# Altium schematic sheet Activity_Recognition_Board_v1.0_MCU.SchDoc
size A4
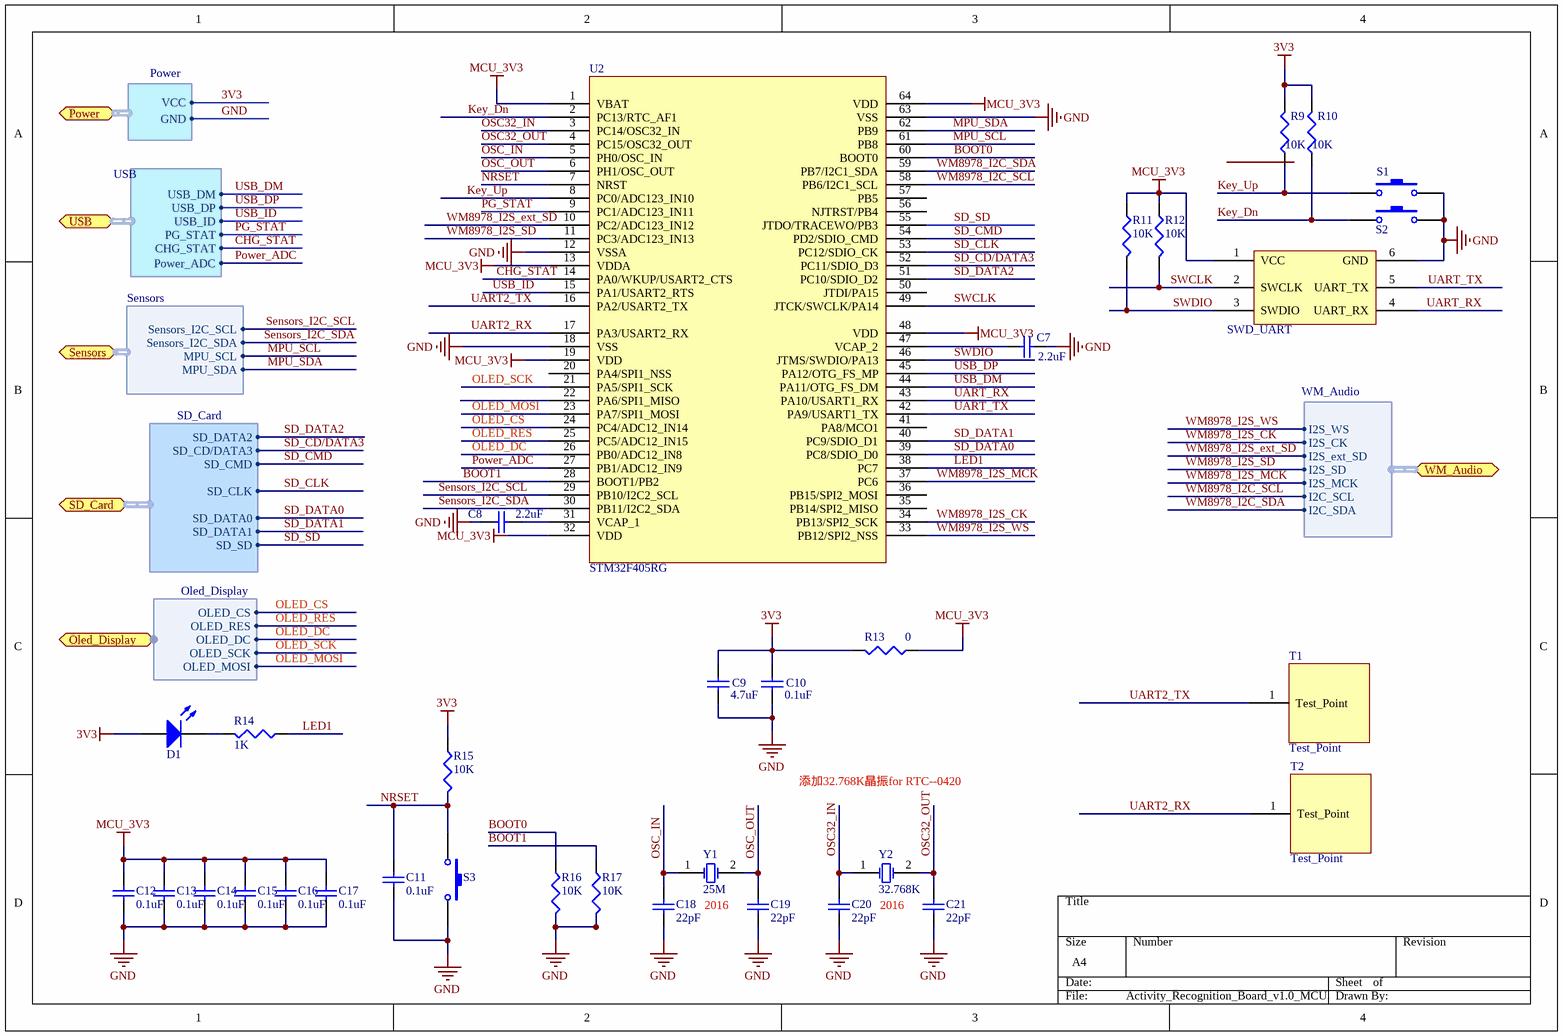
[diagram p0: Activity_Recognition_Board_v1.0_MCU.SchDoc]

## Parts
C7  value 2.2uF  [C0603]  (hidden comment: Cap semi)
C8  value 2.2uF  [C0603]  (hidden comment: Cap semi)
C9  value 4.7uF  [C0603]  (hidden comment: Cap semi)
C10  value 0.1uF  [C0402]  (hidden comment: Cap semi)
C11  value 0.1uF  [C0402]  (hidden comment: Cap semi)
C12  value 0.1uF  [C0402]  (hidden comment: Cap semi)
C13  value 0.1uF  [C0402]  (hidden comment: Cap semi)
C14  value 0.1uF  [C0402]  (hidden comment: Cap semi)
C15  value 0.1uF  [C0402]  (hidden comment: Cap semi)
C16  value 0.1uF  [C0402]  (hidden comment: Cap semi)
C17  value 0.1uF  [C0402]  (hidden comment: Cap semi)
C18  value 22pF  [C0402]  (hidden comment: Cap semi)
C19  value 22pF  [C0402]  (hidden comment: Cap semi)
C20  value 22pF  [C0402]  (hidden comment: Cap semi)
C21  value 22pF  [C0402]  (hidden comment: Cap semi)
D1  LED3  [LED0603]  (value not drawn)
R9  value 10K  [R0402]  (hidden comment: Res3)
R10  value 10K  [R0402]  (hidden comment: Res3)
R11  value 10K  [R0402]  (hidden comment: Res3)
R12  value 10K  [R0402]  (hidden comment: Res3)
R13  value 0  [R0603]  (hidden comment: Res3)
R14  value 1K  [R0402]  (hidden comment: Res3)
R15  value 10K  [R0402]  (hidden comment: Res3)
R16  value 10K  [R0402]  (hidden comment: Res3)
R17  value 10K  [R0402]  (hidden comment: Res3)
S1  SW-PB  [MP34]  (value not drawn)
S2  SW-PB  [MP34]  (value not drawn)
S3  SW-PB  [MP34]  (value not drawn)
SWD_UART1  SWD_UART  [FFC_6]
T1  Test_Point  [Test_Point]
T2  Test_Point  [Test_Point]
U2  STM32F405RG  [LQFP64]
Y1  25M  [3225]
Y2  32.768K  [3215]

## Ports
Oled_Display (harness Oled_Display), Power (harness Power), SD_Card (harness SD_Card), Sensors (harness Sensors), USB (harness USB), WM_Audio (harness WM_Audio)

## Harnesses
Power: VCC, GND
USB: USB_DM, USB_DP, USB_ID, PG_STAT, CHG_STAT, Power_ADC
Sensors: Sensors_I2C_SCL, Sensors_I2C_SDA, MPU_SDA, MPU_SCL
SD_Card: SD_DATA2, SD_CMD, SD_CD/DATA3, SD_CLK, SD_DATA0, SD_DATA1, SD_SD
WM_Audio: I2S_WS, I2S_CK, I2S_ext_SD, I2S_SD, I2S_MCK, I2C_SCL, I2C_SDA
Oled_Display: OLED_CS, OLED_RES, OLED_DC, OLED_SCK, OLED_MOSI

## Nets
3V3: C9.1 C10.1 D1.1(A) R9.2 R10.2 R13.2 R15.1 ; port Power.VCC
GND: C7.1 C8.2 C9.2 C10.2 C11.1 C12.1 C13.1 C14.1 C15.1 C16.1 C17.1 C18.1 C19.1 C20.1 C21.1 R16.2 R17.2 S1.2 S2.2 S3.2 SWD_UART1.6(GND) U2.12(VSSA) U2.18(VSS) U2.63(VSS) ; port Power.GND
MCU_3V3: C12.2 C13.2 C14.2 C15.2 C16.2 C17.2 R11.1 R12.1 R13.1 SWD_UART1.1(VCC) U2.1(VBAT) U2.13(VDDA) U2.19(VDD) U2.32(VDD) U2.48(VDD) U2.64(VDD)
BOOT0: R16.1 U2.60(BOOT0)
BOOT1: R17.1 U2.28(BOOT1/PB2)
CHG_STAT: U2.14(PA0/WKUP/USART2_CTS) ; port USB.CHG_STAT
Key_Dn: R10.1 S2.1 U2.2(PC13/RTC_AF1)
Key_Up: R9.1 S1.1 U2.8(PC0/ADC123_IN10)
LED1: R14.1 U2.38(PC7)
MPU_SCL: U2.61(PB8) ; port Sensors.MPU_SCL
MPU_SDA: U2.62(PB9) ; port Sensors.MPU_SDA
NRSET: C11.2 R15.2 S3.1 U2.7(NRST)
OLED_CS: U2.24(PC4/ADC12_IN14) ; port Oled_Display.OLED_CS
OLED_DC: U2.26(PB0/ADC12_IN8) ; port Oled_Display.OLED_DC
OLED_MOSI: U2.23(PA7/SPI1_MOSI) ; port Oled_Display.OLED_MOSI
OLED_RES: U2.25(PC5/ADC12_IN15) ; port Oled_Display.OLED_RES
OLED_SCK: U2.21(PA5/SPI1_SCK) ; port Oled_Display.OLED_SCK
OSC32_IN: C20.2 U2.3(PC14/OSC32_IN) Y2.1(OSC1)
OSC32_OUT: C21.2 U2.4(PC15/OSC32_OUT) Y2.2(OSC2)
OSC_IN: C18.2 U2.5(PH0/OSC_IN) Y1.1(OSC1)
OSC_OUT: C19.2 U2.6(PH1/OSC_OUT) Y1.2(OSC2)
PG_STAT: U2.9(PC1/ADC123_IN11) ; port USB.PG_STAT
Power_ADC: U2.27(PB1/ADC12_IN9) ; port USB.Power_ADC
SD_CD/DATA3: U2.52(PC11/SDIO_D3) ; port SD_Card.SD_CD/DATA3
SD_CLK: U2.53(PC12/SDIO_CK) ; port SD_Card.SD_CLK
SD_CMD: U2.54(PD2/SDIO_CMD) ; port SD_Card.SD_CMD
SD_DATA0: U2.39(PC8/SDIO_D0) ; port SD_Card.SD_DATA0
SD_DATA1: U2.40(PC9/SDIO_D1) ; port SD_Card.SD_DATA1
SD_DATA2: U2.51(PC10/SDIO_D2) ; port SD_Card.SD_DATA2
SD_SD: U2.55(JTDO/TRACEWO/PB3) ; port SD_Card.SD_SD
Sensors_I2C_SCL: U2.29(PB10/I2C2_SCL) ; port Sensors.Sensors_I2C_SCL
Sensors_I2C_SDA: U2.30(PB11/I2C2_SDA) ; port Sensors.Sensors_I2C_SDA
SWCLK: R12.2 SWD_UART1.2(SWCLK) U2.49(JTCK/SWCLK/PA14)
SWDIO: R11.2 SWD_UART1.3(SWDIO) U2.46(JTMS/SWDIO/PA13)
UART2_RX: T2.1(Test_Point) U2.17(PA3/USART2_RX)
UART2_TX: T1.1(Test_Point) U2.16(PA2/USART2_TX)
UART_RX: SWD_UART1.4(UART_RX) U2.43(PA10/USART1_RX)
UART_TX: SWD_UART1.5(UART_TX) U2.42(PA9/USART1_TX)
USB_DM: U2.44(PA11/OTG_FS_DM) ; port USB.USB_DM
USB_DP: U2.45(PA12/OTG_FS_MP) ; port USB.USB_DP
USB_ID: U2.15(PA1/USART2_RTS) ; port USB.USB_ID
WM8978_I2C_SCL: U2.58(PB6/I2C1_SCL) ; port WM_Audio.I2C_SCL
WM8978_I2C_SDA: U2.59(PB7/I2C1_SDA) ; port WM_Audio.I2C_SDA
WM8978_I2S_CK: U2.34(PB13/SPI2_SCK) ; port WM_Audio.I2S_CK
WM8978_I2S_ext_SD: U2.10(PC2/ADC123_IN12) ; port WM_Audio.I2S_ext_SD
WM8978_I2S_MCK: U2.37(PC6) ; port WM_Audio.I2S_MCK
WM8978_I2S_SD: U2.11(PC3/ADC123_IN13) ; port WM_Audio.I2S_SD
WM8978_I2S_WS: U2.33(PB12/SPI2_NSS) ; port WM_Audio.I2S_WS
NetC7_2: C7.2 U2.47(VCAP_2)
NetC8_1: C8.1 U2.31(VCAP_1)
NetD1_2: D1.2(K) R14.2

Not connected (* = marked no-connect by the designer): U2 20(PA4/SPI1_NSS) 22(PA6/SPI1_MISO) 35(PB14/SPI2_MISO) 36(PB15/SPI2_MOSI) 41(PA8/MCO1) 50(JTDI/PA15) 56(NJTRST/PB4) 57(PB5)

## Notes on the sheet
- 添加32.768K晶振for RTC--0420
- 2016

## Library data of the parts
C7-C21 = Cap semi: Capacitor (Semiconductor SIM Model); Published: 8-Jun-2000; LatestRevisionDate: 29-May-2009; LatestRevisionNote: IPC-7351 Footprint Added.; PackageReference: C1206; Publisher: Altium Limited; PackageDescription: Chip Capacitor
D1 = LED3: Typical BLUE SiC LED; Published: 8-Jun-2000; LatestRevisionDate: 17-Dec-2003; LatestRevisionNote: PCB Footprint replaced.; DatasheetVersion: 16-Apr-2002; PackageVersion: 16-Apr-2002; PackageReference: 3.5X2.8X1.9; Publisher: Altium Limited; PackageDescription: SM LED; 2 C-Bend Leads; Body 3.5 x 2.8 x 1.9 mm, inc leads (LxWxH typ)
R9-R17 = Res3: Resistor; Published: 8-Jun-2000; LatestRevisionDate: 29-May-2009; LatestRevisionNote: IPC-7351 Footprint Added.; PackageReference: J1-0603; Publisher: Altium Limited; PackageDescription: Chip Resistor
S1-S3 = SW-PB: Switch; Published: 24-Mar-1999; LatestRevisionDate: 17-Jul-2002; LatestRevisionNote: Re-released for DXP Platform.; PackageReference: SPST-2; Publisher: Altium Limited; PackageDescription: Switch; 2 Leads
Y1 = XTAL: Crystal Oscillator; pin to pad: 2>3; Published: 8-Jun-2000; LatestRevisionDate: 17-Jul-2002; LatestRevisionNote: Re-released for DXP Platform.; PackageReference: R38; Publisher: Altium Limited; PackageDescription: Crystal, Thru-Hole; 2 Leads; Body 3.1 x 8.2 mm (Dia.xH)
Y2 = XTAL: Crystal Oscillator; Published: 8-Jun-2000; LatestRevisionDate: 17-Jul-2002; LatestRevisionNote: Re-released for DXP Platform.; PackageReference: R38; Publisher: Altium Limited; PackageDescription: Crystal, Thru-Hole; 2 Leads; Body 3.1 x 8.2 mm (Dia.xH)